# EAGLE design Cowbell (EAGLE 9.2.2)
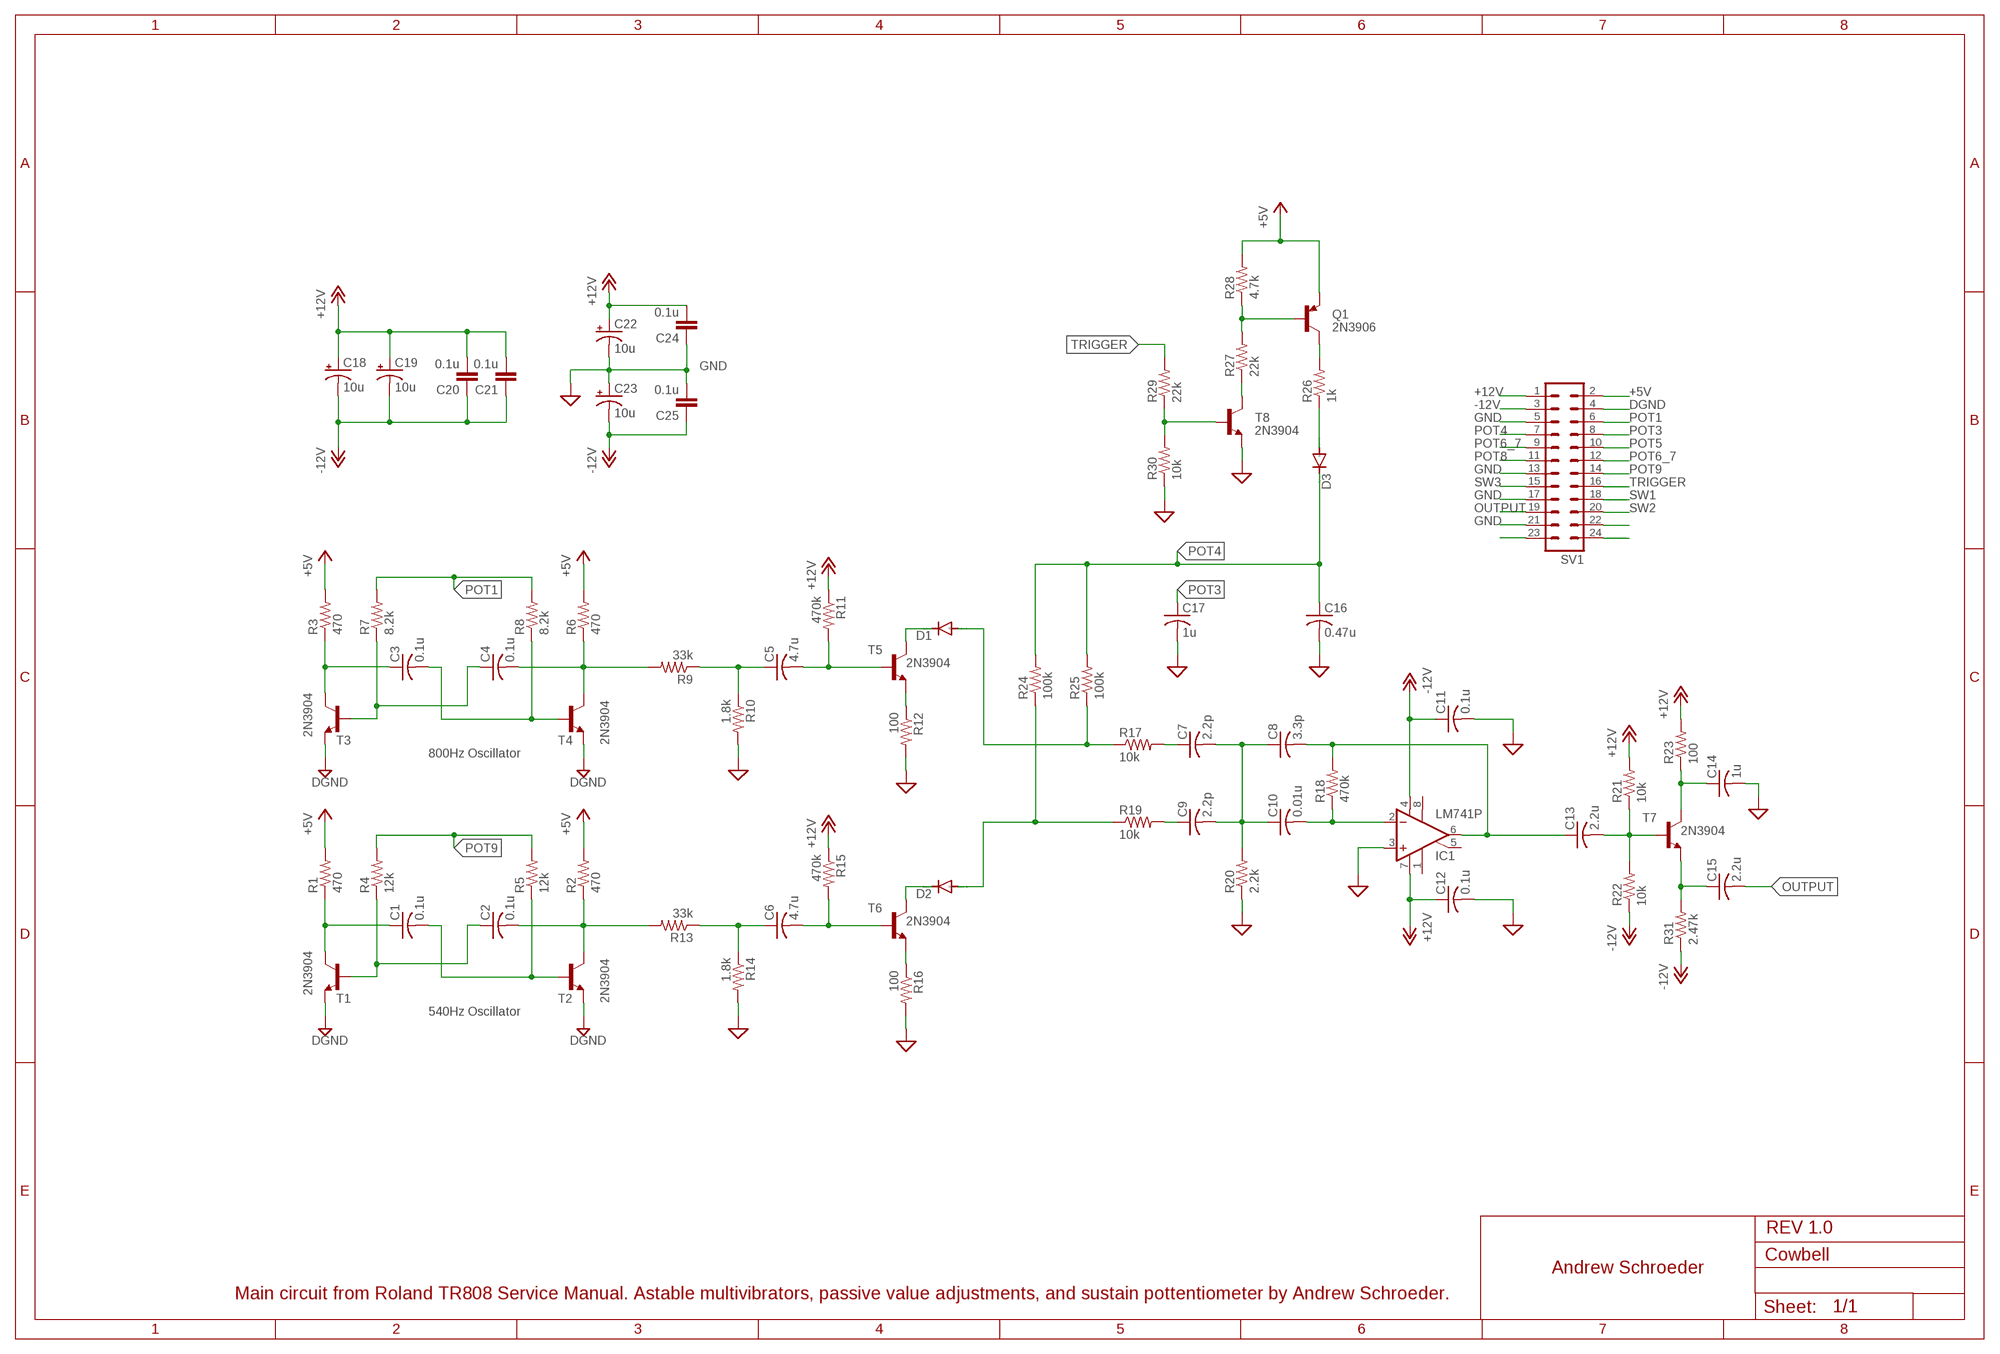
[diagram p0: schematic, sheet 1]

## Parts
C1  0.1u  C-US025-024X044  [C025-024X044]
C2  0.1u  C-US025-024X044  [C025-024X044]
C3  0.1u  C-US025-024X044  [C025-024X044]
C4  0.1u  C-US025-024X044  [C025-024X044]
C5  4.7u  C-US025-024X044  [C025-024X044]
C6  4.7u  C-US025-024X044  [C025-024X044]
C7  2.2p  C-US025-024X044  [C025-024X044]
C8  3.3p  C-US025-024X044  [C025-024X044]
C9  2.2p  C-US025-024X044  [C025-024X044]
C10  0.01u  C-US025-024X044  [C025-024X044]
C11  0.1u  C-US025-024X044  [C025-024X044]
C12  0.1u  C-US025-024X044  [C025-024X044]
C13  2.2u  C-US025-024X044  [C025-024X044]
C14  1u  C-US025-024X044  [C025-024X044]
C15  2.2u  C-US025-024X044  [C025-024X044]
C16  0.47u  C-US025-024X044  [C025-024X044]
C17  1u  C-US025-024X044  [C025-024X044]
C18  10u  CPOL-USE2.5-6  [E2,5-6]
C19  10u  CPOL-USE2.5-6  [E2,5-6]
C20  0.1u  C-EU050-024X044  [C050-024X044]
C21  0.1u  C-EU050-024X044  [C050-024X044]
C22  10u  CPOL-USE2.5-6  [E2,5-6]
C23  10u  CPOL-USE2.5-6  [E2,5-6]
C24  0.1u  C-EU050-024X044  [C050-024X044]
C25  0.1u  C-EU050-024X044  [C050-024X044]
D1  1N4148DO35-7  [DO35-7]
D2  1N4148DO35-7  [DO35-7]
D3  1N4148DO35-7  [DO35-7]
IC1  LM741P  [DIL08]
Q1  2N3906  [TO92]
R1  470  R-US_0207/7  [0207/7]
R2  470  R-US_0207/7  [0207/7]
R3  470  R-US_0207/7  [0207/7]
R4  12k  R-US_0207/7  [0207/7]
R5  12k  R-US_0207/7  [0207/7]
R6  470  R-US_0207/7  [0207/7]
R7  8.2k  R-US_0207/7  [0207/7]
R8  8.2k  R-US_0207/7  [0207/7]
R9  33k  R-US_0207/7  [0207/7]
R10  1.8k  R-US_0207/7  [0207/7]
R11  470k  R-US_0207/7  [0207/7]
R12  100  R-US_0207/7  [0207/7]
R13  33k  R-US_0207/7  [0207/7]
R14  1.8k  R-US_0207/7  [0207/7]
R15  470k  R-US_0207/7  [0207/7]
R16  100  R-US_0207/7  [0207/7]
R17  10k  R-US_0207/7  [0207/7]
R18  470k  R-US_0207/7  [0207/7]
R19  10k  R-US_0207/7  [0207/7]
R20  2.2k  R-US_0207/7  [0207/7]
R21  10k  R-US_0207/7  [0207/7]
R22  10k  R-US_0207/7  [0207/7]
R23  100  R-US_0207/7  [0207/7]
R24  100k  R-US_0207/7  [0207/7]
R25  100k  R-US_0207/7  [0207/7]
R26  1k  R-US_0207/7  [0207/7]
R27  22k  R-US_0207/7  [0207/7]
R28  4.7k  R-US_0207/7  [0207/7]
R29  22k  R-US_0207/7  [0207/7]
R30  10k  R-US_0207/7  [0207/7]
R31  2.47k  R-US_0207/7  [0207/7]
SV1  MA12-2  [MA12-2]
T1  2N3904  [TO92]
T2  2N3904  [TO92]
T3  2N3904  [TO92]
T4  2N3904  [TO92]
T5  2N3904  [TO92]
T6  2N3904  [TO92]
T7  2N3904  [TO92]
T8  2N3904  [TO92]

## Nets
+5V: Q1.3(E) R1.2 R2.2 R3.2 R6.2 R28.2 SV1.2
+12V: C12.1 C18.+ C19.+ C20.2 C21.2 C22.+ C24.2 IC1.7(V+) R11.1 R15.1 R21.2 R23.2 SV1.1
-12V: C11.1 C18.- C19.- C20.1 C21.1 C23.- C25.1 IC1.4(V-) R22.1 R31.1 SV1.3
DGND: SV1.4 T1.3(E) T2.3(E) T3.3(E) T4.3(E)
GND: C11.2 C12.2 C14.2 C16.2 C17.2 C22.- C23.+ C24.1 C25.2 IC1.3(+IN) R10.2 R12.2 R14.2 R16.2 R20.1 R30.1 SV1.5 SV1.13 SV1.17 SV1.21 T8.3(E) ; supply symbol labelled SUP
N$1: C4.2 R6.1 R9.2 T4.1(C)
N$2: C2.2 R2.1 R13.2 T2.1(C)
N$3: C1.1 R1.1 T1.1(C)
N$4: C2.1 R4.1 T1.2(B)
N$5: C3.1 R3.1 T3.1(C)
N$6: C4.1 R7.1 T3.2(B)
N$7: C1.2 R5.1 T2.2(B)
N$8: C3.2 R8.1 T4.2(B)
N$9: C5.1 R9.1 R10.1
N$10: D1.C T5.1(C)
N$11: C5.2 R11.2 T5.2(B)
N$13: R12.1 T5.3(E)
N$14: C6.1 R13.1 R14.1
N$15: C6.2 R15.2 T6.2(B)
N$16: R16.1 T6.3(E)
N$17: D2.C T6.1(C)
N$18: D1.A R17.1 R25.1
N$19: D2.A R19.1 R24.1
N$20: C7.1 R17.2
N$21: C7.2 C8.1 C9.2 C10.1 R20.2
N$22: C8.2 C13.1 IC1.6(OUT) R18.2
N$23: C10.2 IC1.2(-IN) R18.1
N$24: SV1.23
N$25: SV1.24
N$26: SV1.22
N$27: C13.2 R21.1 R22.2 T7.2(B)
N$28: C9.1 R19.2
N$29: Q1.1(C) R26.2
N$30: C14.1 R23.1 T7.1(C)
N$31: C15.1 R31.2 T7.3(E)
N$32: R27.1 T8.1(C)
N$34: D3.A R26.1
N$37: R29.1 R30.2 T8.2(B)
N$39: Q1.2(B) R27.2 R28.1
OUTPUT: C15.2 SV1.19
POT1: R7.2 R8.2 SV1.6
POT3: C17.1 SV1.8
POT4: C16.1 D3.C R24.2 R25.2 SV1.7
POT5: SV1.10
POT6_7: SV1.9 SV1.12
POT8: SV1.11
POT9: R4.2 R5.2 SV1.14
SW1: SV1.18
SW2: SV1.20
SW3: SV1.15
TRIGGER: R29.2 SV1.16
Unconnected: IC1.1(ON1) IC1.5(ON2) IC1.8(OPT)

## Notes on the sheet
- 800Hz Oscillator
- 540Hz Oscillator
- REV 1.0
- Andrew Schroeder
- Main circuit from Roland TR808 Service Manual. Astable multivibrators, passive value adjustments, and sustain pottentiometer by Andrew Schroeder.

## Library data of the parts
C1-C17 = rcl:C-US: CAPACITOR, American symbol; SPICEPREFIX: C
C18 C19 C22 C23 = rcl:CPOL-US: POLARIZED CAPACITOR, American symbol; SPICEPREFIX: C
C20 C21 C24 C25 = resistor:C-EU: CAPACITOR, European symbol
D1-D3 = diode:1N4148: DIODE high speed (Philips)
IC1 = linear:*741: OP AMP
Q1 = transistor-pnp:2N3906: PNP Transistor
R1-R31 = rcl:R-US_: RESISTOR, American symbol; SPICEPREFIX: R
SV1 = con-lstb:MA12-2: PIN HEADER; OC_FARNELL: unknown; OC_NEWARK: unknown
T1-T8 = transistor:2N3904: NPN TRANSISTOR

## Board
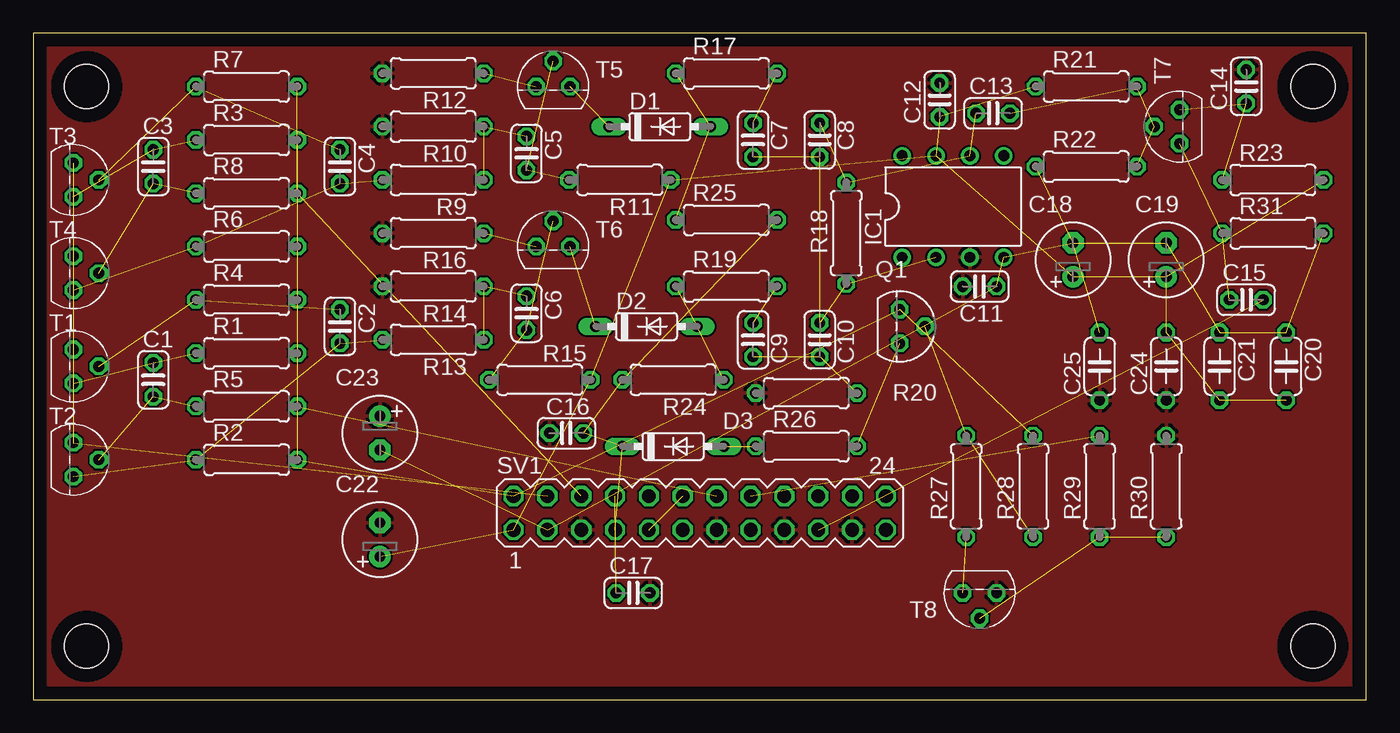
[diagram p1: board, top side]

Size 100 x 50 mm. Coordinates in mm from the lower left corner, seen from the top.
Outline: 0,0 100,0 100,50 0,50 0,0
Copper layers (1*16): Top 0.035mm / dielectric 1.5mm / Bottom 0.035mm
Design rules "default": minimum track width 6mil, minimum drill 0.35mm, track to track 6mil, track to pad 6mil, pad to pad 6mil, via to via 6mil, smd to smd 6mil, copper to edge 40mil, drill to drill 6mil, minimum pad ring 10mil, minimum via ring 8mil, stop-mask expansion 4mil, vias tented up to drill 0mil, thermal gap 10mil

### Footprints (pad centres in the part's own frame; a part is rotated, then mirrored left to right if it is on the bottom)
C025-024X044 = drill 0.813 octagon: 1 -1.27,0; 2 1.27,0
E2,5-6 = drill 0.813 pad 1.6: + -1.27,0 | drill 0.813 pad 1.6 octagon: - 1.27,0
C050-024X044 = drill 0.813 octagon: 1 -2.54,0; 2 2.54,0
DO35-7 = drill 0.813 long: A 3.81,0; C -3.81,0
DIL08 = drill 0.813 pad 1.27: 1 -3.81,-3.81; 2 -1.27,-3.81; 3 1.27,-3.81; 4 3.81,-3.81; 5 3.81,3.81; 6 1.27,3.81; 7 -1.27,3.81; 8 -3.81,3.81
TO92 = drill 0.813 octagon: 1 1.27,0; 2 0,1.905; 3 -1.27,0
0207/7 = drill 0.813 octagon: 1 -3.81,0; 2 3.81,0
MA12-2 = drill 1.016 octagon: 1 -13.97,-1.27; 2 -13.97,1.27; 3 -11.43,-1.27; 4 -11.43,1.27; 5 -8.89,-1.27; 6 -8.89,1.27; 7 -6.35,-1.27; 8 -6.35,1.27; 9 -3.81,-1.27; 10 -3.81,1.27; 11 -1.27,-1.27; 12 -1.27,1.27; 13 1.27,-1.27; 14 1.27,1.27; 15 3.81,-1.27; 16 3.81,1.27; 17 6.35,-1.27; 18 6.35,1.27; 19 8.89,-1.27; 20 8.89,1.27; 21 11.43,-1.27; 22 11.43,1.27; 23 13.97,-1.27; 24 13.97,1.27
STAND-OFF = hole 3.302: 0,0

### Placement (x,y rotation side)
C1  9,24 270 top
C2  23,28 270 top
C3  9,40 270 top
C4  23,40 270 top
C5  37,41 270 top
C6  37,29 270 top
C7  54,42 270 top
C8  59,42 90 top
C9  54,27 270 top
C10  59,27 90 top
C11  71,31 180 top
C12  68,45 90 top
C13  72,44 0 top
C14  91,46 90 top
C15  91,30 0 top
C16  40,20 180 top
C17  45,8 0 top
C18  78,33 90 top
C19  85,33 90 top
C20  94,25 270 top
C21  89,25 270 top
C22  26,12 90 top
C23  26,20 270 top
C24  85,25 90 top
C25  80,25 270 top
D1  47,43 0 top
D2  46,28 0 top
D3  48,19 0 top
IC1  69,37 0 top
Q1  65,28 270 top
R1  16,26 0 top
R2  16,18 0 top
R3  16,42 0 top
R4  16,30 0 top
R5  16,22 0 top
R6  16,34 0 top
R7  16,46 0 top
R8  16,38 0 top
R9  30,39 180 top
R10  30,43 180 top
R11  44,39 180 top
R12  30,47 180 top
R13  30,27 180 top
R14  30,31 180 top
R15  38,24 180 top
R16  30,35 180 top
R17  52,47 0 top
R18  61,35 90 top
R19  52,31 0 top
R20  58,23 0 top
R21  79,46 180 top
R22  79,40 0 top
R23  93,39 0 top
R24  48,24 180 top
R25  52,36 0 top
R26  58,19 0 top
R27  70,16 90 top
R28  75,16 90 top
R29  80,16 90 top
R30  85,16 270 top
R31  93,35 180 top
SV1  50,14 0 top
T1  3,25 270 top
T2  3,18 270 top
T3  3,39 270 top
T4  3,32 270 top
T5  39,46 0 top
T6  39,34 0 top
T7  86,43 90 top
T8  71,8 180 top
U$1  [STAND-OFF]  4,46 0 top
U$2  [STAND-OFF]  4,4 0 top
U$3  [STAND-OFF]  96,4 0 top
U$4  [STAND-OFF]  96,46 0 top
U$6  [A5L-LOC]  -46,-42 0 top  (outside the outline)

### Tracks (layer width: path | path; a pad name or v marks a point on that pad's centre or on a via)
+5V  (6 unrouted)
+12V  (12 unrouted)
-12V  (10 unrouted)
DGND  (4 unrouted)
GND
  pour Top: -1,51 101,51 101,-1 -1,-1
N$1  (3 unrouted)
N$2  (3 unrouted)
N$3  (2 unrouted)
N$4  (2 unrouted)
N$5  (2 unrouted)
N$6  (2 unrouted)
N$7  (2 unrouted)
N$8  (2 unrouted)
N$9  (2 unrouted)
N$10  (1 unrouted)
N$11  (2 unrouted)
N$13  (1 unrouted)
N$14  (2 unrouted)
N$15  (2 unrouted)
N$16  (1 unrouted)
N$17  (1 unrouted)
N$18  (2 unrouted)
N$19  (2 unrouted)
N$20  (1 unrouted)
N$21  (4 unrouted)
N$22  (3 unrouted)
N$23  (2 unrouted)
N$27  (3 unrouted)
N$28  (1 unrouted)
N$29  (1 unrouted)
N$30  (2 unrouted)
N$31  (2 unrouted)
N$32  (1 unrouted)
N$34  (1 unrouted)
N$37  (2 unrouted)
N$39  (2 unrouted)
OUTPUT  (1 unrouted)
POT1  (2 unrouted)
POT3  (1 unrouted)
POT4  (4 unrouted)
POT6_7  (1 unrouted)
POT9  (2 unrouted)
TRIGGER  (1 unrouted)

### Text on the board
Document: REV 1.0 | Andrew Schroeder